# Altium project PCB_Project.PrjPcb
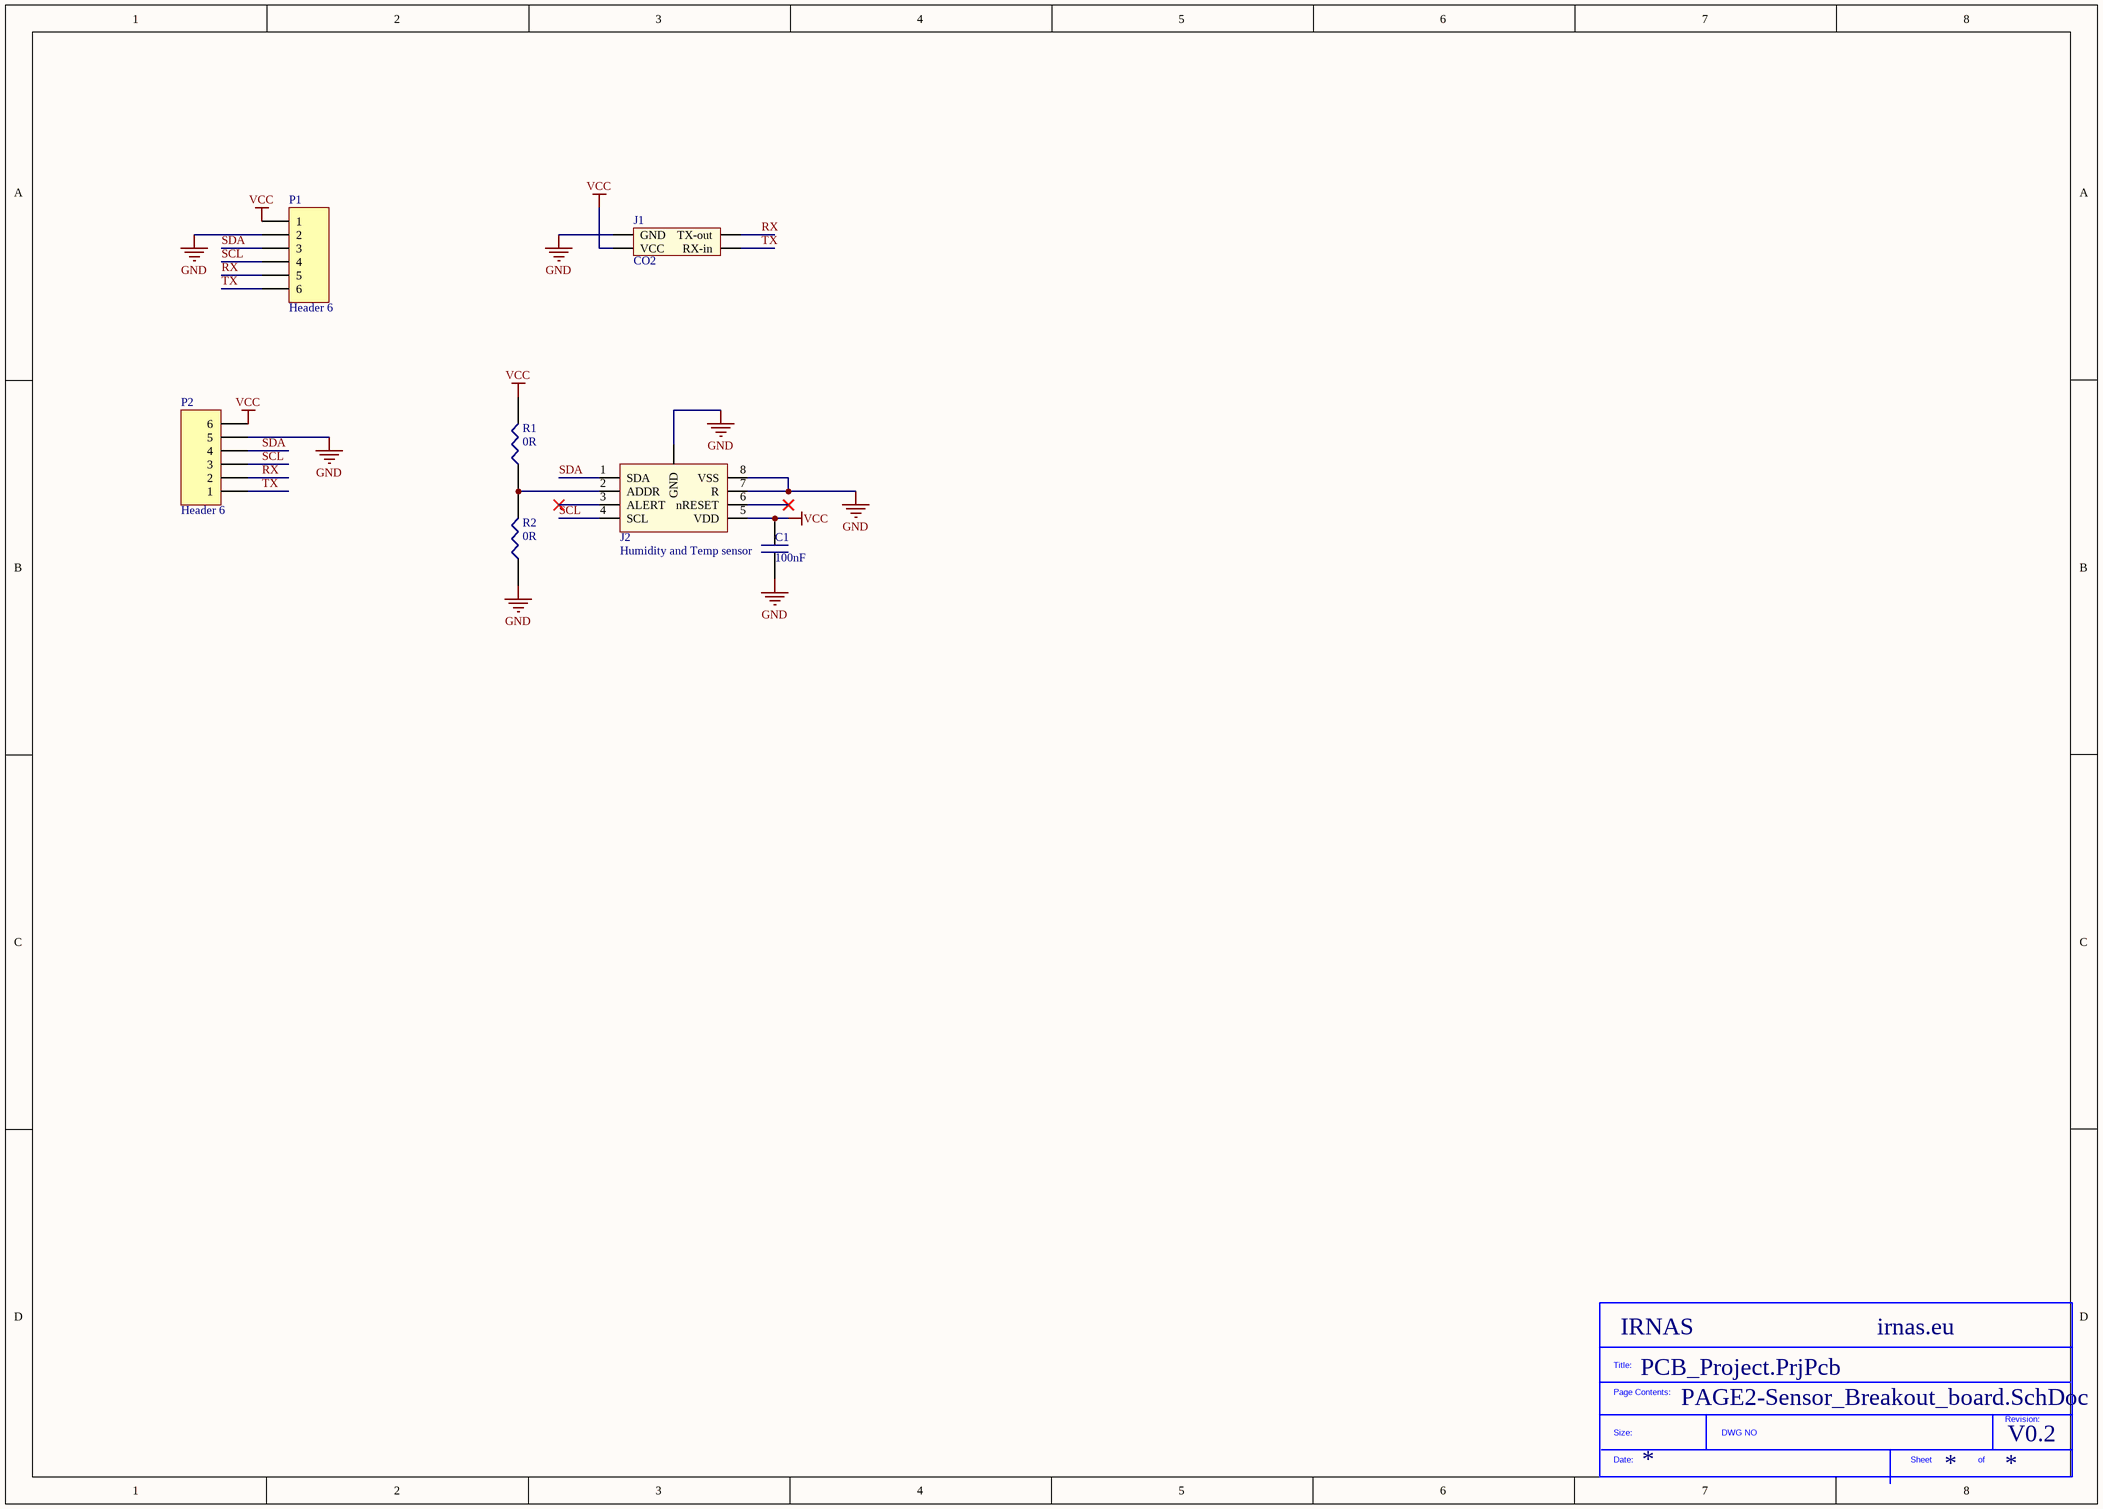
[diagram p0: PAGE2-Sensor_Breakout_board.SchDoc]
ProjectTitle: Sensor breakout board; Website: irnas.eu; Version: V0.2; Company: IRNAS
1 sheet, 8 parts. Net scope: global (net labels, ports and power ports of the same name join across sheets).
Board file: Sensor_breakout.PcbDoc

## Sheet PAGE2-Sensor_Breakout_board.SchDoc
size A3

### Parts
*?  SDTitleBlock  (value not drawn)  (graphical)
C1  100nF  [CAP0603]
J1  CO2  [CO2]
J2  Humidity and Temp sensor  [SHT3x-DIS]
P1  Header 6  [HDR1X6]
P2  Header 6  [HDR1X6]
R1  0R  [RES0603]
R2  0R  [RES0603]

### Nets
GND: C1.1 J1.1(GND) J2.7(R) J2.8(VSS) J2.9(GND) P1.2 P2.5 R2.1
VCC: C1.2 J1.2(VCC) J2.5(VDD) P1.1 P2.6 R1.2
RX: J1.3(TX-out) P1.5 P2.2
SCL: J2.4(SCL) P1.4 P2.3
SDA: J2.1(SDA) P1.3 P2.4
TX: J1.4(RX-in) P1.6 P2.1
NetJ2_2: J2.2(ADDR) R1.1 R2.2

Not connected (* = marked no-connect by the designer): J2 3(ALERT)* 6(nRESET)*

### Notes on the sheet
- (in symbol SDTitleBlock) Title:; Page Contents:; Revision:; Size:; DWG NO; Date:; Sheet; of

### Library data of the parts
J2 = Humidity and Temp
P1 P2 = Header 6: Header, 6-Pin; LatestRevisionDate: 17-Jul-2002; LatestRevisionNote: Re-released for DXP Platform.; Publisher: Altium Limited
R1 R2 = 0R: Thick Film Resistors - SMD 0.0ohm 1%; Manufacturer: Yageo; Manufacturer Part Number: RC0603FR-070RL; Product Training Modules: Chip Resistor; Catalog Drawings: Thick Film Resistor Side; PCN Other: RC/AC 0603/0805/1206 22/Jan/2013; HTML Datasheet: RC Series, L Suffix Datasheet.html; EDA / CAD Models: Download from Accelerated Designs; Resistance (Ohms): 0.0; Tolerance: Jumper; Power (Watts): 0.1W, 1/10W; Online Catalog: RC0603 Series; Other Names: 311-0.0HRTR  Q3106287A  RC0603FR-070RL-ND; Supplier 1: Farnell; Stock 1: 12704; Pricing 1: 10=0.021, 100=0.018, 500=0.0126, 1000=0.0105, 2500=0.0079 (GBP); Standard Package: 5,000; Category: Resistors; Family: Chip Resistor - Surface Mount; Series: RC; Packaging: Tape & Reel (TR); Composition: Thick Film; Features: Moisture Resistant; Temperature Coefficient: -; Operating Temperature: -55°C ~ 155°C; Package / Case: 0603 (1608 Metric); Supplier Device Package: 0603; Size / Dimension: 0.063" L x 0.031" W (1.60mm x 0.80mm); Height: 0.022" (0.55mm); Number of Terminations: 2; Supplier Part Number 1: 2309106